# EAGLE design nrf52840-breakout-qwiic-lipo (EAGLE 9.1.2)
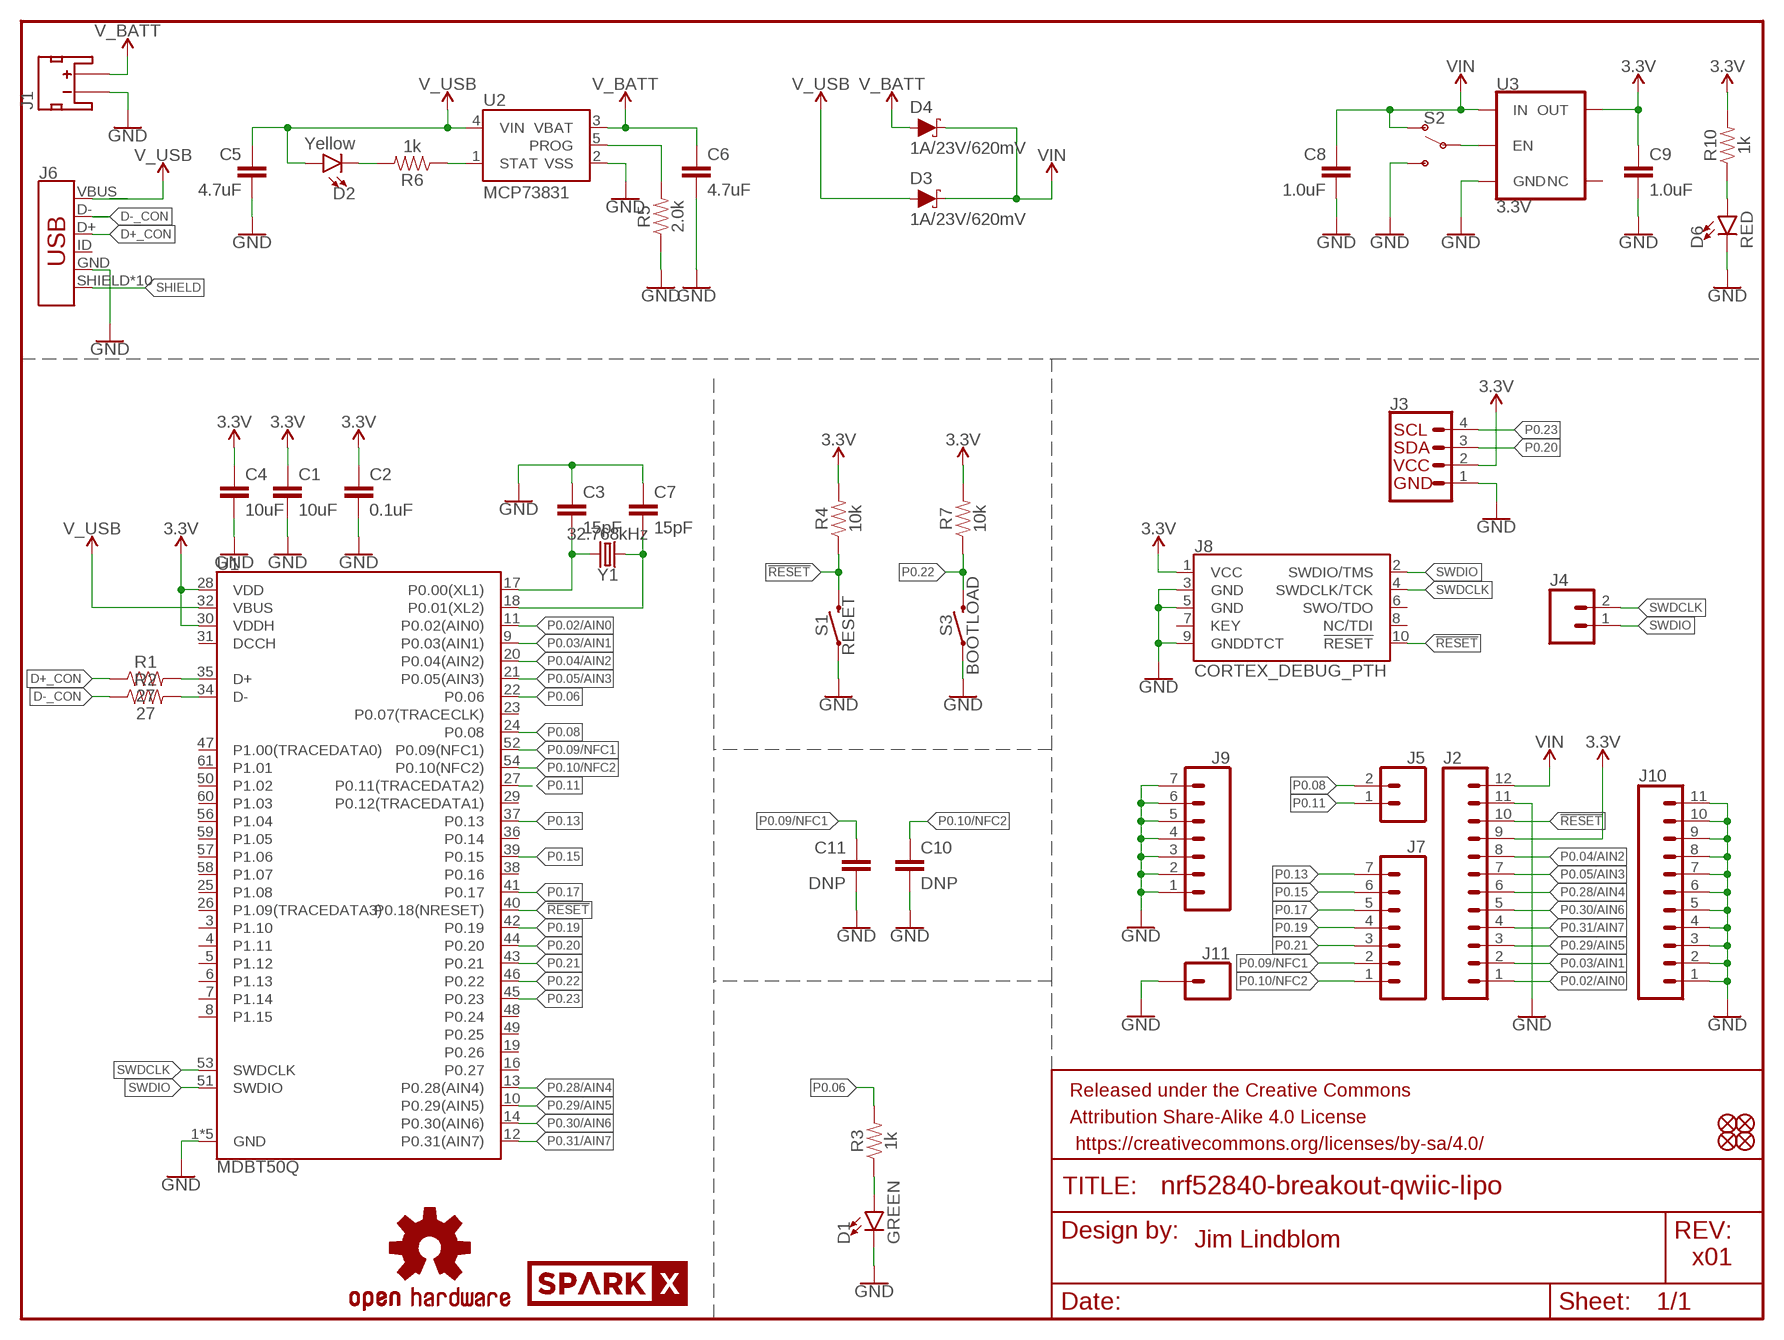
[diagram p0: schematic, sheet 1]

## Parts
C1  10uF  10UF-0603-6.3V-20%  [0603]
C2  0.1uF  0.1UF-0603-25V-(+80/-20%)  [0603]
C3  15pF  15PF-0603-50V-5%  [0603]
C4  10uF  10UF-0603-6.3V-20%  [0603]
C5  4.7uF  4.7UF-0603-6.3V-(10%)  [0603]
C6  4.7uF  4.7UF-0603-6.3V-(10%)  [0603]
C7  15pF  15PF-0603-50V-5%  [0603]
C8  1.0uF  1.0UF-0603-16V-10%  [0603]
C9  1.0uF  1.0UF-0603-16V-10%  [0603]
C10  DNP  270PF-0603-50V-5%  [0603]
C11  DNP  270PF-0603-50V-5%  [0603]
D1  GREEN  LED-GREEN0603  [LED-0603]
D2  Yellow  LED-YELLOW0603  [LED-0603]
D3  1A/23V/620mV  DIODE-SCHOTTKY-BAT20J  [SOD-323]
D4  1A/23V/620mV  DIODE-SCHOTTKY-BAT20J  [SOD-323]
D6  RED  LED-RED0603  [LED-0603]
FD1  FIDUCIALUFIDUCIAL  [FIDUCIAL-MICRO]
FD2  FIDUCIALUFIDUCIAL  [FIDUCIAL-MICRO]
FD3  FIDUCIALUFIDUCIAL  [FIDUCIAL-MICRO]
FD4  FIDUCIALUFIDUCIAL  [FIDUCIAL-MICRO]
FRAME1  FRAME-LETTER  [CREATIVE_COMMONS]
J1  JST_2MM_MALESMD  [JST-2-SMD]
J2  CONN_12NO_SILK  [1X12_NO_SILK]
J3  QWIIC_CONNECTORJS-1MM  [1X04_1MM_RA]
J4  CONN_021X02_NO_SILK  [1X02_NO_SILK]
J5  CONN_021X02_NO_SILK  [1X02_NO_SILK]
J6  USB_MICRO-B_HALF_PTH_MILL  [USB-MICROB-PTH-MILL]
J7  CONN_07NO_SILK  [1X07_NO_SILK]
J8  CORTEX_DEBUG_PTH  [2X5-PTH-1.27MM]
J9  CONN_07NO_SILK  [1X07_NO_SILK]
J10  CONN_111X11_NO_SILK  [1X11_NO_SILK]
J11  CONN_01PTH_NO_SILK_YES_STOP  [1X01_NO_SILK]
LOGO1  SPARKX-LOGO3  [SPARKX-SMALL]
LOGO2  OSHW-LOGOM  [OSHW-LOGO-M]
R1  27  27OHM-0603-1/10W-1%  [0603]
R2  27  27OHM-0603-1/10W-1%  [0603]
R3  1k  1KOHM-0603-1/10W-1%  [0603]
R4  10k  10KOHM-0603-1/10W-1%  [0603]
R5  2.0k  2.0KOHM-0603-1/10W-5%  [0603]
R6  1k  1KOHM-0603-1/10W-1%  [0603]
R7  10k  10KOHM-0603-1/10W-1%  [0603]
R10  1k  1KOHM-0603-1/10W-1%  [0603]
S1  RESET  MOMENTARY-SWITCH-SPST-SMD-RIGHT-ANGLE  [TACTILE_SWITCH_SMD_RIGHT_ANGLE]
S2  SWITCH-SPDT-SMD-RIGHT-ANGLE  [SWITCH_SPST_SMD_A]
S3  BOOTLOAD  MOMENTARY-SWITCH-SPST-SMD-RIGHT-ANGLE  [TACTILE_SWITCH_SMD_RIGHT_ANGLE]
U1  MDBT50Q  [MDBT50Q]
U2  MCP73831  [SOT23-5]
U3  3.3V  V_REG_AP2112K-3.3V  [SOT23-5]
Y1  32.768kHz  CRYSTAL-32.768KHZSMD-3.2X1.5  [CRYSTAL-SMD-3.2X1.5MM]

## Nets
3.3V [vcc]: C1.1 C2.1 C4.1 C9.1 J2.9 J3.2 J8.1(VCC) R4.2 R7.2 R10.2 U1.28(VDD) U1.30(VDDH) U3.5(OUT)
!RESET: J2.10 J8.10(!RESET) R4.1 S1.2 U1.40(P0.18(NRESET))
D+: R1.2 U1.35(D+)
D+_CON: J6.D+ R1.1
D-: R2.2 U1.34(D-)
D-_CON: J6.D- R2.1
GND: C1.2 C2.2 C3.1 C4.2 C5.2 C6.2 C7.1 C8.2 C9.2 C10.2 C11.2 D1.C D6.C J1.1(-) J2.11 J3.1 J6.GND J8.3(GND) J8.5(GND) J8.9(GNDDTCT) J9.1 J9.2 J9.3 J9.4 J9.5 J9.6 J9.7 J10.1 J10.2 J10.3 J10.4 J10.5 J10.6 J10.7 J10.8 J10.9 J10.10 J10.11 J11.1 R5.1 S1.1 S2.3(S) S3.1 U1.1(GND) U1.2(GND) U1.15(GND) U1.33(GND) U1.55(GND) U2.2(VSS) U3.2(GND)
N$1: R5.2 U2.5(PROG)
N$2: S2.2(P) U3.3(EN)
N$3: D2.C R6.2
N$4: R6.1 U2.1(STAT)
N$7: D1.A R3.1
N$10: D6.A R10.1
P0.02/AIN0: J2.1 U1.11(P0.02(AIN0))
P0.03/AIN1: J2.2 U1.9(P0.03(AIN1))
P0.04/AIN2: J2.8 U1.20(P0.04(AIN2))
P0.05/AIN3: J2.7 U1.21(P0.05(AIN3))
P0.06: R3.2 U1.22(P0.06)
P0.08: J5.2 U1.24(P0.08)
P0.09/NFC1: C11.1 J7.2 U1.52(P0.09(NFC1))
P0.10/NFC2: C10.1 J7.1 U1.54(P0.10(NFC2))
P0.11: J5.1 U1.27(P0.11(TRACEDATA2))
P0.13: J7.7 U1.37(P0.13)
P0.15: J7.6 U1.39(P0.15)
P0.17: J7.5 U1.41(P0.17)
P0.19: J7.4 U1.42(P0.19)
P0.20: J3.3 U1.44(P0.20)
P0.21: J7.3 U1.43(P0.21)
P0.22: R7.1 S3.2 U1.46(P0.22)
P0.23: J3.4 U1.45(P0.23)
P0.28/AIN4: J2.6 U1.13(P0.28(AIN4))
P0.29/AIN5: J2.3 U1.10(P0.29(AIN5))
P0.30/AIN6: J2.5 U1.14(P0.30(AIN6))
P0.31/AIN7: J2.4 U1.12(P0.31(AIN7))
SHIELD: J6.SHIELD J6.SHIELD2(SHIELD) J6.SHIELD3(SHIELD) J6.SHIELD4(SHIELD) J6.SHIELD5(SHIELD) J6.SHIELD6(SHIELD) J6.SHIELD7(SHIELD) J6.SHIELD8(SHIELD) J6.SHIELD9(SHIELD) J6.SHIELD10(SHIELD)
SWDCLK: J4.2 J8.4(SWDCLK/TCK) U1.53(SWDCLK)
SWDIO: J4.1 J8.2(SWDIO/TMS) U1.51(SWDIO)
V_BATT: C6.1 D4.A J1.2(+) U2.3(VBAT)
V_USB: C5.1 D2.A D3.A J6.VBUS U1.32(VBUS) U2.4(VIN)
VIN [vcc]: C8.1 D3.C D4.C J2.12 S2.1(O) U3.1(IN)
XL1: C3.2 U1.17(P0.00(XL1)) Y1.P$2
XL2: C7.2 U1.18(P0.01(XL2)) Y1.P$1
Unconnected: J6.ID J8.6(SWO/TDO) J8.7(KEY) J8.8(NC/TDI) U1.3(P1.10) U1.4(P1.11) U1.5(P1.12) U1.6(P1.13) U1.7(P1.14) U1.8(P1.15) U1.16(P0.27) U1.19(P0.26) U1.23(P0.07(TRACECLK)) U1.25(P1.08) U1.26(P1.09(TRACEDATA3)) U1.29(P0.12(TRACEDATA1)) U1.31(DCCH) U1.36(P0.14) U1.38(P0.16) U1.47(P1.00(TRACEDATA0)) U1.48(P0.24) U1.49(P0.25) U1.50(P1.02) U1.56(P1.04) U1.57(P1.06) U1.58(P1.07) U1.59(P1.05) U1.60(P1.03) U1.61(P1.01) U3.4(NC)

## Notes on the sheet
- Jim Lindblom
- x01

## Library data of the parts
C1 C4 = SparkFun-Capacitors:10UF: 10.0µF ceramic capacitors A capacitor is a passive two-terminal electrical component used to store electrical energy temporarily in an electric field.; PROD_ID: CAP-11015
C2 = SparkFun-Capacitors:0.1UF: 0.1µF ceramic capacitors A capacitor is a passive two-terminal electrical component used to store electrical energy temporarily in an electric field.; PROD_ID: CAP-00810
C3 C7 = SparkFun-Capacitors:15PF: 15pF ceramic capacitors A capacitor is a passive two-terminal electrical component used to store electrical energy temporarily in an electric field.; PROD_ID: CAP-07881
C5 C6 = SparkFun-Capacitors:4.7UF: 4.7µF ceramic capacitors A capacitor is a passive two-terminal electrical component used to store electrical energy temporarily in an electric field.; PROD_ID: CAP-08280
C8 C9 = SparkFun-Capacitors:1.0UF: 1µF ceramic capacitors A capacitor is a passive two-terminal electrical component used to store electrical energy temporarily in an electric field.; PROD_ID: CAP-00868
C10 C11 = SparkFun-Capacitors:270PF: 270pF/0.27nF ceramic capacitors A capacitor is a passive two-terminal electrical component used to store electrical energy temporarily in an electric field.; PROD_ID: CAP-13339; VALUE: 270PF
D1 = SparkFun-LED:LED-GREEN: Green SMD LED Used in manufacturing of various products at SparkFun Packages: 0603 - SMD 0603 package [Product Link] <http://www.futureelectronics.com/en/technologies/semiconductors/optoelectronics/leds/Pages/9894312-LTST-C190GKT.aspx?CrossPart=HSMG-C190&IM=0> LilyPad 1206 - SMD1206 LilyPad package [Product Link] <http://www.futureelectronics.com/en/Technologies/Product.aspx?ProductID=IN150NGHARVATEKCORPORATION2049943&IM=0> 1206 - SMD1206 package [Product Link] <http://www.futureelectronics.com/en/technologies/semiconductors/optoelectronics/leds/Pages/8315665-LTST-C150KGKT.aspx?IM=0> 1206 Bottom Mount -SMD 1206 Bottom Mount [Product Link] <http://www.digikey.com/product-detail/en/lite-on-inc/LTST-C230KGKT/160-1456-1-ND/386854> SparkFun Products: Pro Mini 328 -5V <https://www.sparkfun.com/products/821> RedBoard <https://www.sparkfun.com/products/12757> MP3 Trigger <https://www.sparkfun.com/products/13720> Makey Makey <https://www.sparkfun.com/products/11076>; PROD_ID: DIO-00821
D2 = SparkFun-LED:LED-YELLOW: Yellow SMD LED Used in manufacturing several products at SparkFun. Packages: 0603 - SMD 0603 package[Product Link] <http://www.kingbrightusa.com/product.asp?catalog_name=LED&product_id=APT1608SYCK> 0603 -SMART - SMART SMD 0603 package (more efficient/more expensive) [Product Link] <http://www.osram-os.com/osram_os/en/products/product-catalog/led-light-emitting-diodes/smartled-0603/ly-l29k/index.jsp> LilyPad - SMD1206 package[Product Datasheet] <https://www.sparkfun.com/datasheets/DevTools/LilyPad/Q150YUS4.pdf> SparkFun Products: Blynk Board <https://www.sparkfun.com/products/13794> IOIO-OTG <https://www.sparkfun.com/products/13613> XBee Explorer Serial <https://www.sparkfun.com/products/13225>; PROD_ID: DIO-09003
D3 D4 = SparkFun-DiscreteSemi:DIODE-SCHOTTKY: Schottky diode A Schottky diode is a semiconductor diode which has a low forward voltage drop and a very fast switching action.; PROD_ID: DIO-11623
D6 = SparkFun-LED:LED-RED: Red SMD LED Used in manufacturing of most products at SparkFun Packages: 0603 - SMD 0603 package [Product Link] <http://docs.avagotech.com/docs/AV02-0551EN> 0603 SMART - SMD 0603 SMART package ( more efficient and expensive)[Product Link] <http://www.osram-os.com/Graphics/XPic2/00077099_0.pdf> 1206 - SMD1206 package [Product Link] <https://www.sparkfun.com/datasheets/DevTools/LilyPad/Q150OVS4.pdff> SparkFun Products: Pro Mini 328 -5V <https://www.sparkfun.com/products/821> RedBoard <https://www.sparkfun.com/products/12757> IOIO-OTG <https://www.sparkfun.com/products/13613>; PROD_ID: DIO-00819
FD1-FD4 = SparkFun-Aesthetics:FIDUCIAL: Fiducial Alignment Points Point-of-reference for pick-and-place machines and other optical instruments.
FRAME1 = SparkFun-Aesthetics:FRAME-LETTER: Schematic Frame - Letter Standard 8.5x11 US Letter frame
J1 = SparkFun-Connectors:JST_2MM_MALE: JST 2MM MALE RA CONNECTOR Two pin, compact surface mount connector. Commonly used as a battery input connection point. We really like the solid locking feeling and high current rating on these small connectors. We use these all the time as battery connectors. Mates to single-cell LiPo batteries. Here is the connector we sell at SparkFun: JST Right Angle Connector - White <https://www.sparkfun.com/products/8612> (PRT-08612) Datasheet <http://www.sparkfun.com/datasheets/Prototyping/Connectors/JST-Horizontal.pdf> It was used on these SparkFun products: SparkFun MOSFET Power Controller <https://www.sparkfun.com/products/11214> (PRT-11214) SparkFun Battery Babysitter - LiPo Battery Manager <https://www.sparkfun.com/products/13777> (PRT-13777) And many, many others that required a lipo battery connection.; PROD_ID: CONN-11443; SF_ID: PRT-08612
J2 = SparkFun-Connectors:CONN_12: Multi connection point. Often used as Generic Header-pin footprint for 0.1 inch spaced/style header connections On any of the 0.1 inch spaced packages, you can populate with these: Break Away Headers - Straight <https://www.sparkfun.com/products/116> (PRT-00116) Break Away Male Headers - Right Angle <https://www.sparkfun.com/products/553> (PRT-00553) Female Headers <https://www.sparkfun.com/products/115> (PRT-00115) Break Away Headers - Machine Pin <https://www.sparkfun.com/products/117> (PRT-00117) Break Away Female Headers - Swiss Machine Pin <https://www.sparkfun.com/products/743> (PRT-00743) For SCREWTERMINALS and SPRING TERMINALS visit here: Screw Terimnals on SparkFun.com <https://www.sparkfun.com/search/results?term=Screw+Terminals> (5mm/3.5mm/2.54mm spacing) This device is also useful as a general connection point to wire up your design to another part of your project. Our various solder wires solder well into these plated through hole pads. Hook-Up Wire - Assortment (Stranded, 22 AWG) <https://www.sparkfun.com/products/11375> (PRT-11375) Hook-Up Wire - Assortment (Solid Core, 22 AWG) <https://www.sparkfun.com/products/11367> (PRT-11367) View the entire wire category on our website here <https://www.sparkfun.com/categories/141> Special notes: Molex polarized connector foot print use with SKU : PRT-08231 with associated crimp pins and housings. 1MM SMD Version SKU: PRT-10208 NOTES ON THE VARIANTS LOCK and LOCK_LONGPADS... This footprint was designed to help hold the alignment of a through-hole component (i.e. 6-pin header) while soldering it into place. You may notice that each hole has been shifted either up or down by 0.005 of an inch from it's more standard position (which is a perfectly straight line). This slight alteration caused the pins (the squares in the middle) to touch the edges of the holes. Because they are alternating, it causes a "brace" to hold the component in place. 0.005 has proven to be the perfect amount of "off-center" position when using our standard breakaway headers. Although looks a little odd when you look at the bare footprint, once you have a header in there, the alteration is very hard to notice. Also,if you push a header all the way into place, it is covered up entirely on the bottom side.
J3 = SparkFun-Connectors:QWIIC_CONNECTOR: SparkFun I2C Standard Qwiic Connector An SMD 1mm pitch JST connector makes it easy and quick (get it? Qwiic?) to connect I2C devices to each other. The Qwiic system <http://www.sparkfun.com/qwiic> enables fast and solderless connection between popular platforms and various sensors and actuators. We carry 200mm <https://www.sparkfun.com/products/14204>, 100mm <https://www.sparkfun.com/products/14205>, 50mm <https://www.sparkfun.com/products/14206>, and breadboard friendly <https://www.sparkfun.com/products/14207> Qwiic cables. We also offer 10 pcs strips <https://www.sparkfun.com/products/14323> the SMD connectors.; PROD_ID: CONN-13694
J4 J5 = SparkFun-Connectors:CONN_02: Multi connection point. Often used as Generic Header-pin footprint for 0.1 inch spaced/style header connections On any of the 0.1 inch spaced packages, you can populate with these: Break Away Headers - Straight <https://www.sparkfun.com/products/116> (PRT-00116) Break Away Male Headers - Right Angle <https://www.sparkfun.com/products/553> (PRT-00553) Female Headers <https://www.sparkfun.com/products/115> (PRT-00115) Break Away Headers - Machine Pin <https://www.sparkfun.com/products/117> (PRT-00117) Break Away Female Headers - Swiss Machine Pin <https://www.sparkfun.com/products/743> (PRT-00743) For SCREWTERMINALS and SPRING TERMINALS visit here: Screw Terimnals on SparkFun.com <https://www.sparkfun.com/search/results?term=Screw+Terminals> (5mm/3.5mm/2.54mm spacing) This device is also useful as a general connection point to wire up your design to another part of your project. Our various solder wires solder well into these plated through hole pads. Hook-Up Wire - Assortment (Stranded, 22 AWG) <https://www.sparkfun.com/products/11375> (PRT-11375) Hook-Up Wire - Assortment (Solid Core, 22 AWG) <https://www.sparkfun.com/products/11367> (PRT-11367) View the entire wire category on our website here <https://www.sparkfun.com/categories/141> Special notes: Molex polarized connector foot print use with: PRT-08233 with associated crimp pins and housings. 2.54_SCREWTERM for use with PRT-10571. 3.5mm Screw Terminal footprints for PRT-08084 5mm Screw Terminal footprints for use with PRT-08432
J6 = SparkFun-Connectors:USB_MICRO-B: USB Type Micro-B Connector Male/female and PTH/SMT variants SparkFun Products: SparkFun microB USB Breakout <https://www.sparkfun.com/products/12035> SparkFun USB microB Plug Breakout <https://www.sparkfun.com/products/10031> SparkFun ESP8266 Thing <https://www.sparkfun.com/products/13231>; PROD_ID: CONN-13711
J7 J9 = SparkFun-Connectors:CONN_07: Multi connection point. Often used as Generic Header-pin footprint for 0.1 inch spaced/style header connections On any of the 0.1 inch spaced packages, you can populate with these: Break Away Headers - Straight <https://www.sparkfun.com/products/116> (PRT-00116) Break Away Male Headers - Right Angle <https://www.sparkfun.com/products/553> (PRT-00553) Female Headers <https://www.sparkfun.com/products/115> (PRT-00115) Break Away Headers - Machine Pin <https://www.sparkfun.com/products/117> (PRT-00117) Break Away Female Headers - Swiss Machine Pin <https://www.sparkfun.com/products/743> (PRT-00743) For SCREWTERMINALS and SPRING TERMINALS visit here: Screw Terimnals on SparkFun.com <https://www.sparkfun.com/search/results?term=Screw+Terminals> (5mm/3.5mm/2.54mm spacing) This device is also useful as a general connection point to wire up your design to another part of your project. Our various solder wires solder well into these plated through hole pads. Hook-Up Wire - Assortment (Stranded, 22 AWG) <https://www.sparkfun.com/products/11375> (PRT-11375) Hook-Up Wire - Assortment (Solid Core, 22 AWG) <https://www.sparkfun.com/products/11367> (PRT-11367) View the entire wire category on our website here <https://www.sparkfun.com/categories/141> Special notes: Molex polarized connector foot print use with SKU : PRT-08231 with associated crimp pins and housings. 1MM SMD Version SKU: PRT-10208 NOTES ON THE VARIANTS LOCK and LOCK_LONGPADS... This footprint was designed to help hold the alignment of a through-hole component (i.e. 6-pin header) while soldering it into place. You may notice that each hole has been shifted either up or down by 0.005 of an inch from it's more standard position (which is a perfectly straight line). This slight alteration caused the pins (the squares in the middle) to touch the edges of the holes. Because they are alternating, it causes a "brace" to hold the component in place. 0.005 has proven to be the perfect amount of "off-center" position when using our standard breakaway headers. Although looks a little odd when you look at the bare footprint, once you have a header in there, the alteration is very hard to notice. Also,if you push a header all the way into place, it is covered up entirely on the bottom side.
J8 = SparkFun-Connectors:CORTEX_DEBUG: Cortex Debug Connector - 10 pin Supports JTAG debug, Serial Wire debug, and Serial Wire Viewer. PTH and SMD connector options available. General Connector Information <http://infocenter.arm.com/help/topic/com.arm.doc.faqs/attached/13634/cortex_debug_connectors.pdf> Products: PTH Connector <http://www.digikey.com/product-detail/en/cnc-tech/3220-10-0100-00/1175-1627-ND/3883661> -via Digi-Key SparkFun PSoc <https://www.sparkfun.com/products/13229> SparkFun T <https://www.sparkfun.com/products/13810>
J10 = SparkFun-Connectors:CONN_11: Multi connection point. Often used as Generic Header-pin footprint for 0.1 inch spaced/style header connections On any of the 0.1 inch spaced packages, you can populate with these: Break Away Headers - Straight <https://www.sparkfun.com/products/116> (PRT-00116) Break Away Male Headers - Right Angle <https://www.sparkfun.com/products/553> (PRT-00553) Female Headers <https://www.sparkfun.com/products/115> (PRT-00115) Break Away Headers - Machine Pin <https://www.sparkfun.com/products/117> (PRT-00117) Break Away Female Headers - Swiss Machine Pin <https://www.sparkfun.com/products/743> (PRT-00743) For SCREWTERMINALS and SPRING TERMINALS visit here: Screw Terimnals on SparkFun.com <https://www.sparkfun.com/search/results?term=Screw+Terminals> (5mm/3.5mm/2.54mm spacing) This device is also useful as a general connection point to wire up your design to another part of your project. Our various solder wires solder well into these plated through hole pads. Hook-Up Wire - Assortment (Stranded, 22 AWG) <https://www.sparkfun.com/products/11375> (PRT-11375) Hook-Up Wire - Assortment (Solid Core, 22 AWG) <https://www.sparkfun.com/products/11367> (PRT-11367) View the entire wire category on our website here <https://www.sparkfun.com/categories/141>
J11 = SparkFun-Connectors:CONN_01: Single connection point. Often used as Generic Header-pin footprint for 0.1 inch spaced/style header connections On any of the 0.1 inch spaced packages, you can populate with these: Break Away Headers - Straight <https://www.sparkfun.com/products/116> (PRT-00116) Break Away Male Headers - Right Angle <https://www.sparkfun.com/products/553> (PRT-00553) Female Headers <https://www.sparkfun.com/products/115> (PRT-00115) Break Away Headers - Machine Pin <https://www.sparkfun.com/products/117> (PRT-00117) Break Away Female Headers - Swiss Machine Pin <https://www.sparkfun.com/products/743> (PRT-00743) This device is also useful as a general connection point to wire up your design to another part of your project. Our various solder wires solder well into these plated through hole pads. Hook-Up Wire - Assortment (Stranded, 22 AWG) <https://www.sparkfun.com/products/11375> (PRT-11375) Hook-Up Wire - Assortment (Solid Core, 22 AWG) <https://www.sparkfun.com/products/11367> (PRT-11367) View the entire wire category on our website here <https://www.sparkfun.com/categories/141> Special notes: SMTSO-256-ET is a "flush mount" nut for a 4-40 screw. We mostly use this on specialty testbeds; it is a nice way to connect hardware to your PCB at an adjustable hieght. Also note, the SNAP packages are for using a snappable style connector. We sell a baggie of snaps and they are also used on two LilyPad designs: Snap Assortment - 30 pack (male and female) <https://www.sparkfun.com/products/11347> (DEV-11347) LilyPad Arduino SimpleSnap <https://www.sparkfun.com/products/10941> (DEV-10941) LilyPad SimpleSnap Protoboard <https://www.sparkfun.com/products/10940> (DEV-10940)
LOGO1 = SparkX:SPARKX-LOGO
LOGO2 = SparkFun-Aesthetics:OSHW-LOGO: Open-Source Hardware (OSHW) Logo This logo indicates the piece of hardware it is found on incorporates a OSHW license and/or adheres to the definition of open source hardware found here: http://freedomdefined.org/OSHW
R1 R2 = SparkFun-Resistors:27OHM: 27Ω resistor A resistor is a passive two-terminal electrical component that implements electrical resistance as a circuit element. Resistors act to reduce current flow, and, at the same time, act to lower voltage levels within circuits. - Wikipedia; PROD_ID: RES-09334
R3 R6 R10 = SparkFun-Resistors:1KOHM: 1kΩ resistor A resistor is a passive two-terminal electrical component that implements electrical resistance as a circuit element. Resistors act to reduce current flow, and, at the same time, act to lower voltage levels within circuits. - Wikipedia; PROD_ID: RES-07856
R4 R7 = SparkFun-Resistors:10KOHM: 10kΩ resistor A resistor is a passive two-terminal electrical component that implements electrical resistance as a circuit element. Resistors act to reduce current flow, and, at the same time, act to lower voltage levels within circuits. - Wikipedia; PROD_ID: RES-00824
R5 = SparkFun-Resistors:2.0KOHM: 2kΩ resistor A resistor is a passive two-terminal electrical component that implements electrical resistance as a circuit element. Resistors act to reduce current flow, and, at the same time, act to lower voltage levels within circuits. - Wikipedia; PROD_ID: RES-08296
S1 S3 = SparkFun-Switches:MOMENTARY-SWITCH-SPST: Momentary Switch (Pushbutton) - SPST Normally-open (NO) SPST momentary switches (buttons, pushbuttons). Variants PTH-12MM - 12mm square, through-hole Momentary Pushbutton Switch - 12mm Square <https://www.sparkfun.com/products/9190> (COM-09190) PTH-6.0MM, PTH-6.0MM-KIT - 6.0mm square, through-hole Mini Pushbutton Switch <https://www.sparkfun.com/products/97> (COM-00097) KIT package intended for soldering kit's - only one side of pads' copper is exposed. PTH-RIGHT-ANGLE-KIT - Right-angle, through-hole Right Angle Tactile Button <https://www.sparkfun.com/products/10791> - Used on SparkFun BigTime Watch Kit <https://www.sparkfun.com/products/11734> SMD-12MM - 12mm square, surface-mount Tactile Button - SMD (12mm) <https://www.sparkfun.com/products/12993> (COM-12993) Used on SparkFun PicoBoard <https://www.sparkfun.com/products/11888> SMD-4.5MM - 4.5mm Square Trackball Switch Used on SparkFun Blackberry Trackballer Breakout <https://www.sparkfun.com/products/13169> SMD-4.6MMX2.8MM - 4.60mm x 2.80mm, surface mount Used on SparkFun SAMD21 Mini Breakout <https://www.sparkfun.com/products/13664> SMD-5.2MM, SMD-5.2-REDUNDANT - 5.2mm square, surface-mount Mini Pushbutton Switch - SMD <https://www.sparkfun.com/products/8720> (COM-08720) Used on Arduino Pro Mini <https://www.sparkfun.com/products/11114> REDUNDANT package connects both switch circuits together SMD-6.0X3.5MM - 6.0 x 3.5mm, surface mount Momentary Reset Switch SMD <https://www.sparkfun.com/products/8229> (COM-08229) SMD-6.2MM-TALL - 6.2mm square, surface mount Tactile Button - SMD (6mm) <https://www.sparkfun.com/products/12992> Used on SparkFun Digital Sandbox <https://www.sparkfun.com/products/12651> SMD-RIGHT-ANGLE - Right-angle, surface mount Used on SparkFun Block for Intel® Edison - Arduino <https://www.sparkfun.com/products/13036>; PROD_ID: COMP-12265
S2 = SparkFun-Switches:SWITCH-SPDT: Single Pole, Double Throw (SPDT) Switch Single-pole, double-throw (SPDT) switch. Variant Overview SMD-AYZ0202 Surface Mount DPDT Switch <https://www.sparkfun.com/products/597> (COM-00597) Used on e.g. LilyPad Arduino USB - ATmega32U4 Board <https://www.sparkfun.com/products/12049> PTH-11.6X4.0MM SPDT Mini Power Switch <https://www.sparkfun.com/products/102> (COM-00102) Used on e.g. SparkFun Simon Says - Through-Hole Soldering Kit <https://www.sparkfun.com/products/10547> (KIT-10547) PTH-11.6X4.0MM-KIT KIT version of SPDT Mini Power Switch - Simplifies soldering by removing tStop of switch pins - only one side can be soldered. PTH-11.6X4.0MM-LOCK LOCK version of SPDT Mini Power Switch - Offset pins hold switch in place for easier soldering. SMD-RIGHT-ANGLE Surface Mount Right Angle Switch <https://www.sparkfun.com/products/10860> (COM-10860) Used on e.g. SparkFun ESP8266 Thing <https://www.sparkfun.com/products/13231>; PROD_ID: SWCH-10651; SF_SKU: COM-10860
U1 = nrf52840:MDBT50Q
U2 = SparkFun-IC-Power:MCP73831: MCP73831T Li-Ion, Li-Pol Controller Miniature single cell, fully integrated Li-Ion, Li-polymer charge management controller Datasheet <http://ww1.microchip.com/downloads/en/DeviceDoc/20001984g.pdf> SparkFun Products: SparkFun ESP32 Thing <https://www.sparkfun.com/products/13907> SparkFun 9DoF Razor IMU M0 <https://www.sparkfun.com/products/14001>; PROD_ID: IC-09995
U3 = SparkFun-IC-Power:V_REG_AP2112: AP2112 - 600mA CMOS LDO Regulator w/ Enable The AP2112 is CMOS process low dropout linear regulator with enable function, the regulator delivers a guaranteed 600mA (min.) continuous load current. Features Output Voltage Accuracy: ±1.5% Output Current: 600mA (Min.) Foldback Short Current Protection: 50mA Enable Function to Turn ON/OFF VOUT Low Dropout Voltage (3.3V): 250mV (Typ.) @IOUT=600mA Excellent Load Regulation: 0.2%/A (Typ.) Excellent Line Regulation: 0.02%/V (Typ.) Low Quiescent Current: 55μA (Typ.) Low Standby Current: 0.01μA (Typ.) Low Output Noise: 50μVRMS PSRR: 100Hz -65dB, 1kHz -65dB OTSD Protection Stable with 1.0μF Flexible Cap: Ceramic, Tantalum and Aluminum Electrolytic Operation Temperature Range: -40°C to 85°C ESD: MM 400V, HBM 4000V; PROD_ID: VREG-12457
Y1 = SparkFun-Clocks:CRYSTAL-32.768KHZ: 32.768kHz Crystal Frequency: 32.768kHz Frequency Stability: ±20ppm Load Capacitance: 12.5pF (PTH-2X6 & SMD-3.2X1.5), 6pF (SMD-2X6) SparkFun Products: SparkFun BigTime Watch Kit <https://www.sparkfun.com/products/11734> SparkFun nRF52832 Breakout <https://www.sparkfun.com/products/13990> SparkFun Real Time Clock Module <https://www.sparkfun.com/products/12708>; PROD_ID: XTAL-13062

## Net classes
0 default: width 0 mm, drill 0 mm
1 vcc: width 0 mm

## Board
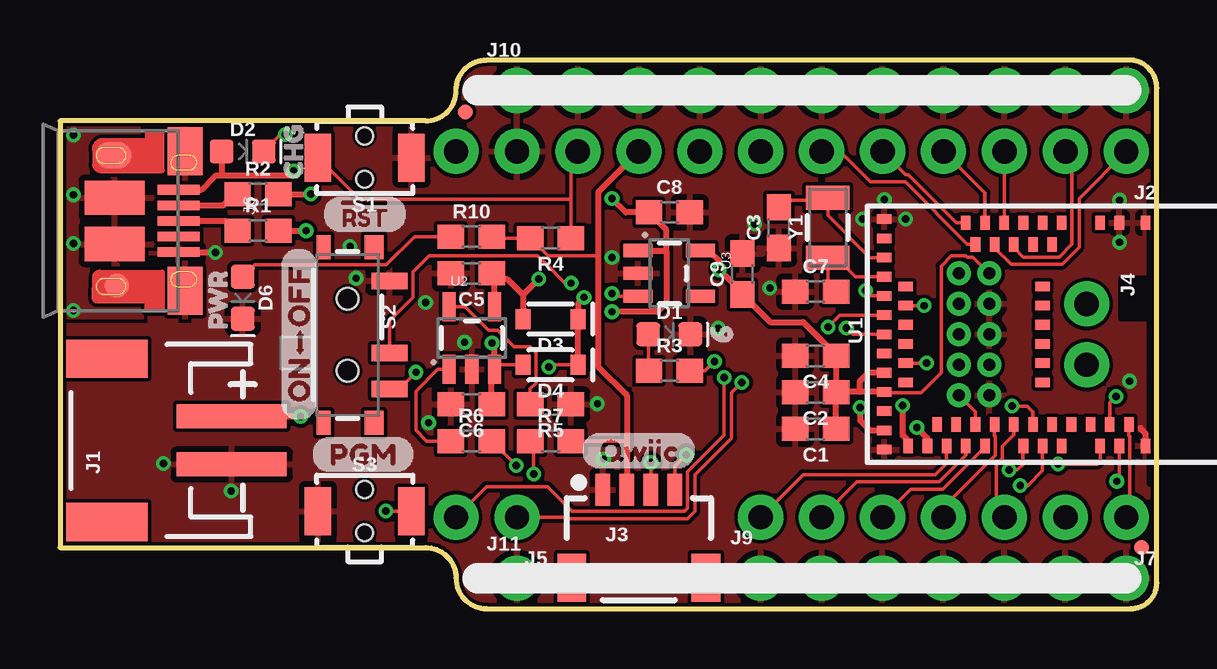
[diagram p1: board, top side]
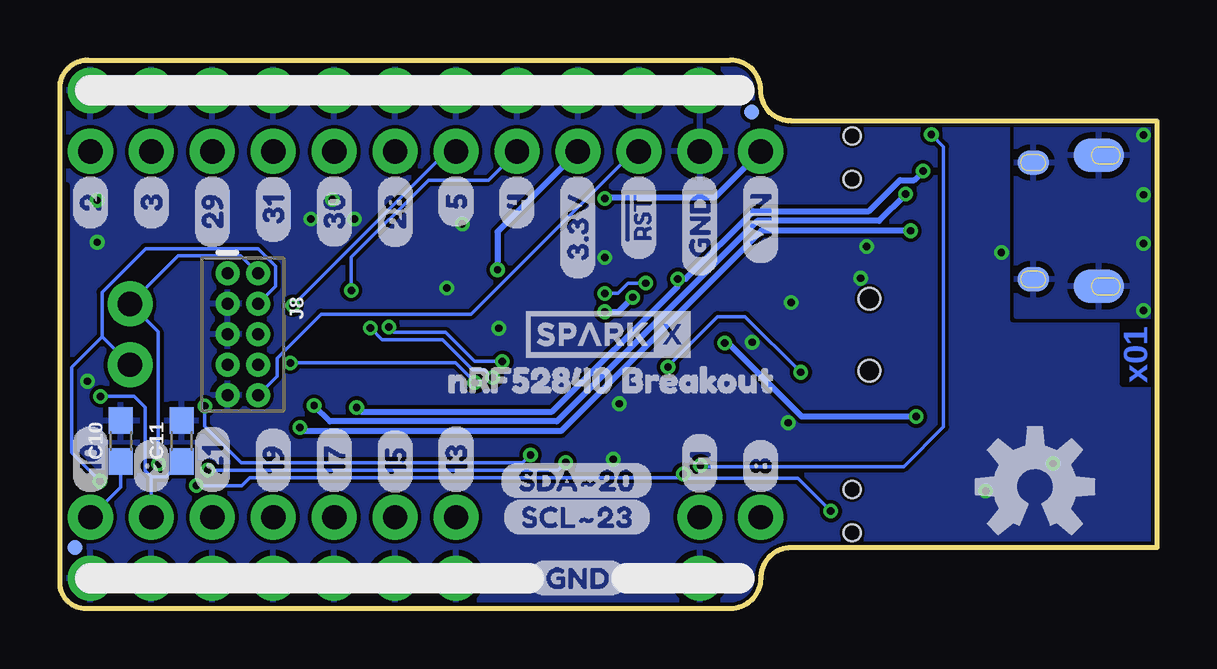
[diagram p2: board, bottom side, seen from below]

Size 45.72 x 22.86 mm. Coordinates in mm from the lower left corner, seen from the top.
Outline: 0,2.54 15.24,2.54 arc-90 16.51,1.27 arc90 17.78,0 44.65,0 arc90 45.72,1.07 45.72,21.7 arc90 44.56,22.86 17.78,22.86 arc90 16.51,21.59 arc-90 15.24,20.32 0,20.32 0,2.54
Copper layers (1*16): Top 0.035mm / dielectric 1.5mm / Bottom 0.035mm
Design rules "SparkFun-2-layer-PCBWay-LIMIT": minimum track width 6mil, minimum drill 0.3mm, track to track 6mil, track to pad 6mil, pad to pad 6mil, via to via 6mil, smd to smd 6mil, copper to edge 6mil, drill to drill 6mil, minimum pad ring 6mil, minimum via ring 6mil, stop-mask expansion 4mil, vias tented up to drill 25mil, thermal gap 10mil

### Footprints (pad centres in the part's own frame; a part is rotated, then mirrored left to right if it is on the bottom)
0603 = smd 1.1 x 1: 1 -0.85,0; 2 0.85,0
LED-0603 = smd 1 x 1: A -0.877,0; C 0.877,0
SOD-323 = smd 0.63 x 0.83: A 1.15,0; C -1.15,0
FIDUCIAL-MICRO = smd 0.635 x 0.635: 1 0,0
JST-2-SMD = smd 1 x 4.6: 1 -1,-3.7; 2 1,-3.7 | smd 1.6 x 3.4: NC1 -3.4,1.5; NC2 3.4,1.5
1X12_NO_SILK = drill 1.016 pad 1.88: 1 0,0; 2 2.54,0; 3 5.08,0; 4 7.62,0; 5 10.16,0; 6 12.7,0; 7 15.24,0; 8 17.78,0; 9 20.32,0; 10 22.86,0; 11 25.4,0; 12 27.94,0
1X04_1MM_RA = smd 0.6 x 1.35: 1 -1.5,0; 2 -0.5,0; 3 0.5,0; 4 1.5,0 | smd 1.2 x 2: NC1 2.8,-3.675; NC2 -2.8,-3.675
1X02_NO_SILK = drill 1.016 pad 1.88: 1 0,0; 2 2.54,0
USB-MICROB-PTH-MILL = smd 0.4 x 1.75: D+ 0,0; D- -0.65,0; GND 1.3,0; ID 0.65,0; VBUS -1.3,0 | smd 2 x 1.46: SHIELD -2.9,0.275; SHIELD2 2.9,0.275 | smd 1.425 x 2.5: SHIELD3 -0.963,-2.675; SHIELD4 0.963,-2.675 | smd 1.4 x 2.1 bottom: SHIELD5 -2.731,-2.531; SHIELD7 2.729,-2.531 | smd 1 x 1: SHIELD6 2.7,-2.575 | smd 1.1 x 1.5: SHIELD8 -2.731,-2.731 | smd 1 x 1.3 bottom: SHIELD9 -2.43,0.195; SHIELD10 2.43,0.195
1X07_NO_SILK = drill 1.016 pad 1.88: 1 0,0; 2 2.54,0; 3 5.08,0; 4 7.62,0; 5 10.16,0; 6 12.7,0; 7 15.24,0
2X5-PTH-1.27MM = drill 0.508 pad 1: 1 -2.54,-0.635; 2 -2.54,0.635; 3 -1.27,-0.635; 4 -1.27,0.635; 5 0,-0.635; 6 0,0.635; 7 1.27,-0.635; 8 1.27,0.635; 9 2.54,-0.635; 10 2.54,0.635
1X11_NO_SILK = drill 1.016 pad 1.88: 1 0,0; 2 2.54,0; 3 5.08,0; 4 7.62,0; 5 10.16,0; 6 12.7,0; 7 15.24,0; 8 17.78,0; 9 20.32,0; 10 22.86,0; 11 25.4,0
1X01_NO_SILK = drill 1.016 pad 1.88: 1 0,0
TACTILE_SWITCH_SMD_RIGHT_ANGLE = smd 1.1 x 2: 1 -1.95,0; 2 1.95,0 | hole 0.7: 0,0.9; 0,-0.9
SWITCH_SPST_SMD_A = smd 0.7 x 1.5: 1 -2.25,-1.75; 2 -0.75,-1.75; 3 2.25,-1.75 | smd 1 x 0.6: GND1 -3.65,1; GND3 3.65,1 | smd 1 x 0.8: GND2 -3.65,-1.1; GND4 3.65,-1.1 | hole 0.9: -1.5,0; 1.5,0
MDBT50Q = smd 0.6 x 0.4: 1 -4.65,3.65; 2 -4.65,2.55; 3 -4.65,1.75; 4 -4.65,0.15; 5 -3.75,-0.25; 6 -4.65,-0.65; 7 -3.75,-1.05; 8 -4.65,-1.45; 9 -3.75,-1.85; 10 -4.65,-2.25; 11 -3.75,-2.65; 12 -4.65,-3.05; 13 -3.75,-3.45; 14 -4.65,-3.85; 34 4.65,-6.25; 35 4.65,-5.45; 36 3.75,-5.05; 37 4.65,-4.65; 38 3.75,-4.25; 39 4.65,-3.85; 40 3.75,-3.45; 41 4.65,-3.05; 42 3.75,-2.65; 43 3.75,-1.85; 44 4.65,-1.45; 45 3.75,-1.05; 46 4.65,-0.65; 47 3.75,-0.25; 48 4.65,0.15; 49 3.75,0.55; 50 3.75,1.35; 51 4.65,1.75; 52 3.75,2.15; 53 4.65,2.55; 54 3.75,2.95; 55 4.65,3.65 | smd 0.4 x 0.6: 15 -4.8,-7.25; 16 -4,-7.25; 17 -3.2,-7.25; 18 -2.4,-7.25; 19 -2,-6.35; 20 -1.6,-7.25; 21 -1.2,-6.35; 22 -0.8,-7.25; 23 -0.4,-6.35; 24 0,-7.25; 25 0.4,-6.35; 26 0.8,-7.25; 27 1.2,-6.35; 28 1.6,-7.25; 29 2,-6.35; 30 2.4,-7.25; 31 3.2,-7.25; 32 4,-7.25; 33 4.8,-7.25; 56 -2,-0.65; 57 -1.2,-0.65; 58 -0.4,-0.65; 59 0.4,-0.65; 60 1.2,-0.65; 61 2,-0.65
SOT23-5 = smd 0.55 x 1.2: 1 -0.95,-1.3; 2 0,-1.3; 3 0.95,-1.3; 4 0.95,1.3; 5 -0.95,1.3
CRYSTAL-SMD-3.2X1.5MM = smd 1 x 1.8: P$1 -1.25,0; P$2 1.25,0

### Placement (x,y rotation side)
C1  31.5,7.49 180 top
C2  31.5,9.02 180 top
C3  29.97,15.88 90 top
C4  31.5,10.54 180 top
C5  17.14,13.97 180 top
C6  17.14,8.51 180 top
C7  31.5,13.21 0 top
C8  25.4,16.51 0 top
C9  28.45,13.94 90 top
C10  43.18,6.99 90 bottom
C11  40.64,6.99 90 bottom
D1  25.4,11.43 0 top
D2  7.62,19.05 0 top
D3  20.45,12.06 180 top
D4  20.45,10.16 180 top
D6  7.62,12.95 270 top
FD1  16.89,20.7 0 top
FD2  45.09,2.54 0 top
FD3  45.09,2.54 0 bottom
FD4  16.89,20.7 0 bottom
FRAME1  2.54,-10.16 0 top  (outside the outline)
J1  3.45,7.01 90 top
J2  44.45,19.05 180 top
J3  24.13,4.95 0 top
J4  42.8,12.7 270 top
J5  19.05,3.81 180 top
J6  4.95,16.15 270 top
J7  44.45,3.81 180 top
J8  38.1,11.43 270 bottom
J9  29.21,1.27 0 top
J10  19.05,21.59 0 top
J11  19.05,1.27 0 top
LOGO1  22.86,11.43 0 bottom
LOGO2  5.08,5.08 0 bottom
R1  8.26,15.75 0 top
R2  8.26,17.27 0 top
R3  25.4,9.91 0 top
R4  20.45,15.44 180 top
R5  20.45,8.51 180 top
R6  17.14,6.99 0 top
R7  20.45,6.99 0 top
R10  17.14,15.49 0 top
S1  12.7,18.8 180 top
S2  11.99,11.4 90 top
S3  12.7,4.06 0 top
U1  41.61,11.43 270 top
U2  17.17,11.28 0 top
U3  25.4,13.97 270 top
U$1  [625]  27.56,10.29 90 top
U$2  [#RST7]  10.79,16.43 0 top
U$3  [PGM2]  10.44,6.43 0 top
U$4  [ON#OFF4]  9.96,7.77 90 top
U$5  [CHG26]  9.73,17.22 90 top
U$6  [PWR27]  6.58,10.97 90 top
U$7  [1125]  19.05,4.75 90 bottom
U$8  [QWIIC0]  21.69,6.58 0 top
U$9  [20]  44.45,15.75 90 bottom
U$10  [31]  41.91,15.75 90 bottom
U$11  [292]  39.37,15.01 90 bottom
U$12  [313]  36.83,15.21 90 bottom
U$13  [304]  34.29,14.99 90 bottom
U$14  [285]  31.75,15.01 90 bottom
U$15  [521]  29.21,15.82 90 bottom
U$16  [421]  26.67,15.75 90 bottom
U$17  [3#3V5]  24.13,13.69 90 bottom
U$18  [#RST6]  21.59,14.38 90 bottom
U$19  [GND7]  19.05,13.69 90 bottom
U$20  [VIN8]  16.51,14.3 90 bottom
U$21  [1022]  44.45,4.8 90 bottom
U$22  [916]  41.91,4.8 90 bottom
U$23  [2111]  39.37,4.62 90 bottom
U$24  [1912]  36.83,4.8 90 bottom
U$25  [1713]  34.29,4.8 90 bottom
U$26  [1522]  31.75,4.75 90 bottom
U$27  [1314]  29.21,4.8 90 bottom
U$29  [816]  16.51,4.8 90 bottom
U$30  [GND6]  26.26,1.27 0 bottom
U$31  [NRF52840_BREAKOUT17]  30.48,9.53 0 bottom
U$32  [SCL#2323]  27.3,3.81 0 bottom
U$33  [SDA#2024]  27.43,5.33 0 bottom
Y1  32,15.88 90 top

### Tracks (layer width: path | path; a pad name or v marks a point on that pad's centre or on a via)
3.3V  (via drill 0.3)
  Top 0.152: J8.1 38.05,14.65 37.81,14.65 37.77,14.7 37.16,14.7 36.74,14.27 36.74,9.83 35.9,9 34.38,9 U1.30 | R7.2 23.63,6.99 | R10.2 18.03,15.49 18.09,15.44 R4.2 20.33,14.71 22.43,14.71
  Top 0.254: U3.5 27.04,14.92 27.48,14.48 v27.48,14.12 28.45,13.16 C9.1 29.61,11.94 30.99,11.94 32.35,10.58 C4.1 C2.1 | C1.1 C2.1 | U1.30 33.33,9.03 | 33.33,9.03 C2.1 | U1.28 33.71,9.83 33.33,9.45 33.33,9.03 | J2.9 22.43,17.35 22.43,14.71 22.43,10.08 23.63,8.88 23.63,6.99 J3.2
  Bottom 0.254: J2.9 27.48,15.7 v27.48,14.12
!RESET
  Top 0.152: U1.40 38.16,8.2 J8.10 | S1.2 12.49,17.06 21.28,17.06 21.3,17.04 | R4.1 21.3,17.04 | 21.3,17.04 21.3,18.76 J2.10
  Bottom 0.152: J2.10 21.8,19.05 28.58,12.27 34.84,12.27 36.68,10.43 36.68,9.68 J8.10
D+  (via drill 0.3)
  Top 0.254: U1.35 36.16,7.1 v35.72,7.54 | R1.2 v10.26,15.75
  Bottom 0.254: v35.72,7.54 35.57,7.39 24.84,7.39 16.48,15.75 v10.26,15.75
D+_CON
  Top 0.254: J6.D+ 6.87,16.15 7.28,15.75 R1.1
D-  (via drill 0.3)
  Top 0.254: U1.34 35.35,6.99 35.12,7.22 v35.12,8.46 | R2.2 v10.46,17.27
  Bottom 0.254: v35.12,8.46 34.47,7.8 25.01,7.8 16.65,16.15 11.58,16.15 v10.46,17.27
D-_CON
  Top 0.254: J6.D- 6.81,16.8 7.28,17.27 R2.1
GND  (via drill 0.3)
  Top 0.254: U1.55 45.26,7.3 45.03,7.52 | v6.48,14.83 4.97,14.83 J6.GND
  other vias: 16.87,11.1 15.37,7.75 15.24,12.75 4.32,6.05 7.14,4.9 22.66,6.22 27.43,11.68 23.01,14.63 28.96,16.03 29.59,13.36 35.26,16.23 33.45,16.23 34.37,17.04 44.17,15.27 44.17,17.02 22.4,8.53 12.34,13.77 44.58,9.47 12.09,15.09
  pour Top (isolate 0.152, rank 6): 0,2.54 15.24,2.54 arc-90 16.51,1.27 arc90 17.78,0 45.72,0 45.72,22.86 17.78,22.86 arc90 16.51,21.59 arc-90 15.24,20.32 0,20.32
  pour Bottom (isolate 0.152, rank 6): 0,2.54 15.24,2.54 arc-90 16.51,1.27 arc90 17.78,0 45.72,0 45.72,22.86 17.78,22.86 arc90 16.51,21.59 arc-90 15.24,20.32 0,20.32
N$1
  Top 0.152: U2.5 16.89,12.57 17.86,11.61 18.24,11.61 18.93,10.91 19.6,10.91 19.84,10.67 19.84,9.4 19.6,9.15 R5.2
N$2  (via drill 0.3)
  Top 0.152: U3.3 23.12,13.02 v23.01,13.13 | S2.2 13.74,12 14.72,12.98 14.72,14.03 15.38,14.7 19.91,14.7 20.21,14.4 21.05,13.56 v21.3,13.56
  Bottom 0.152: v23.01,13.13 22.46,13.13 22.03,13.56 v21.3,13.56
N$3  (via drill 0.3)
  Top 0.152: v19.02,5.97 v19.01,5.97 R6.2 | D2.C 9.21,19.76 v9.4,19.76
  Bottom 0.152: v19.02,5.97 18.97,5.92 10.54,5.92 8.89,7.57 8.89,19.25 v9.4,19.76
N$4
  Top 0.152: U2.1 15.74,9.98 14.83,9.07 14.83,7.43 15.28,6.99 R6.1
N$7
  Top 0.152: D1.A 24.52,9.93 R3.1
N$10
  Top 0.152: D6.A 8.12,14.33 13.6,14.33 14.77,15.49 R10.1
P0.02/AIN0
  Top 0.152: U1.11 38.95,15.04 39.65,14.35 41.78,14.35 42.49,15.06 42.49,17.09 J2.1
P0.03/AIN1
  Top 0.152: U1.9 39.76,15.06 40.16,14.65 41.65,14.65 42.18,15.19 42.18,18.79 J2.2
P0.04/AIN2  (via drill 0.3)
  Top 0.152: U1.20 33.81,13.03 v33.58,13.26
  Bottom 0.152: v33.58,13.26 33.58,14.63 30.35,17.86 27.86,17.86 J2.8
P0.05/AIN3  (via drill 0.3)
  Top 0.152: U1.21 v36.01,12.63 v36.02,12.62
  Bottom 0.152: v36.02,12.62 29.59,19.05 J2.7
P0.06  (via drill 0.3)
  Top 0.152: v32.02,11.73 32.51,12.23 U1.22 | R3.2 26.89,9.91 v27.28,10.3
  Bottom 0.152: v32.02,11.73 31.79,11.51 29.64,11.51 28.43,10.3 v27.28,10.3
P0.08  (via drill 0.3)
  Top 0.152: U1.24 33.05,11.43 v32.78,11.7 | v27.69,9.63 27.69,7.24 26.16,5.71 26.16,4.18 26.02,4.05 21.35,4.05 20.32,5.08 17.78,5.08 J5.2
  Bottom 0.152: v32.78,11.7 32.28,11.2 29.77,11.2 28.52,9.96 28.02,9.96 v27.69,9.63
P0.09/NFC1  (via drill 0.3)
  Top 0.152: U1.52 43.76,8.57 v44.03,8.84
  Bottom 0.152: C11.1 41.29,5.49 41.9,5.49 | J7.2 41.91,5.49 41.9,5.49 | 41.9,5.49 42.16,5.75 42.16,8.38 42.62,8.84 v44.03,8.84
P0.10/NFC2
  Top 0.152: U1.54 44.55,7.2 44.58,7.17 44.58,3.94 J7.1
  Bottom 0.152: C10.1 43.18,5.07 44.44,3.81 J7.1
P0.11  (via drill 0.3)
  Top 0.152: J5.1 21.16,3.81 21.22,3.75 26.15,3.75 26.46,4.06 26.46,5.58 27.99,7.11 27.99,8.99 v28.42,9.42 | U1.27 v36.11,10.23 v36.12,10.24
  Bottom 0.152: v36.12,10.24 29.23,10.24 v28.42,9.42
P0.13
  Top 0.152: J7.7 30.99,5.59 36.5,5.59 36.95,6.04 U1.37
P0.15
  Top 0.152: J7.6 33.22,5.28 36.65,5.28 37.76,6.39 U1.39
P0.17
  Top 0.152: J7.5 35.46,4.98 36.8,4.98 38.55,6.73 U1.41
P0.19
  Top 0.152: U1.42 38.95,7.2 38.98,7.17 38.98,6.38 36.83,4.23 J7.4
P0.20  (via drill 0.3)
  Top 0.152: J3.3 24.63,6.09 v24.64,6.1 | U1.44 40.13,6.76 40.13,5.99 39.91,5.78 v39.56,5.78
  Bottom 0.152: v24.64,6.1 24.97,5.77 39.55,5.77 v39.56,5.78
P0.21
  Top 0.152: U1.43 39.76,7.24 39.29,6.78 39.29,6.26 39.03,6 39.03,4.15 J7.3
P0.22  (via drill 0.3)
  Top 0.152: U1.46 40.95,5.74 40.34,5.13 v40.03,5.13 | v13.59,4.06 S3.2 | R7.1 19.75,6.83 v19.75,5.61
  Bottom 0.152: v13.59,4.06 14.96,5.44 19.57,5.44 v19.75,5.61 19.9,5.46 37.81,5.46 38.15,5.13 v40.03,5.13
P0.23  (via drill 0.3)
  Top 0.152: J3.4 25.63,5.93 v26.1,6.41 | v39.68,8.44 40.33,8.44 40.55,8.21 U1.45
  Bottom 0.152: v26.1,6.41 26.43,6.08 38.16,6.08 39.68,7.6 v39.68,8.44
P0.28/AIN4
  Top 0.152: U1.13 37.83,15.18 35.23,17.78 33.78,17.78 32.51,19.05 J2.6
P0.29/AIN5
  Top 0.152: U1.10 39.37,16.09 J2.3
P0.30/AIN6
  Top 0.152: U1.14 37.36,16.08 35.36,18.09 35.26,18.09 J2.5
P0.31/AIN7
  Top 0.152: U1.12 38.55,17.32 J2.4
SHIELD  (via drill 0.3)
  other vias: 0.56,12.42 0.56,15.21 0.56,17.25 0.56,19.74
  pour Top (isolate 0.152): 0,12.19 5.46,12.19 5.46,20.32 0,20.32
  pour Bottom (isolate 0.152): 0,12.19 5.84,12.19 5.84,20.32 0,20.32
SWDCLK  (via drill 0.3)
  Top 0.152: U1.53 44.16,5.41 v44.05,5.31
  Bottom 0.152: J8.4 36.74,13.43 36.74,14.27 37.47,15 42.15,15 43.97,13.18 43.97,11.33 | 43.97,11.33 J4.2 | v44.05,5.31 45.24,6.5 45.24,10.06 43.97,11.33
SWDIO  (via drill 0.3)
  Top 0.152: U1.51 43.35,6.14 43.23,6.02 v41.6,6.02
  Bottom 0.152: J8.2 38.19,14.7 40.8,14.7 J4.1 41.63,11.53 41.63,6.05 v41.6,6.02
V_BATT  (via drill 0.3)
  Top 0.152: D4.A 18.3,10.16 U2.3
  Top 0.254: C6.1 18,9.85 U2.3 18.12,10.96 v18.01,11.07 | v10.03,8 7.11,8 7.12,8.01 J1.2
  Bottom 0.254: v10.03,8 14.79,8 17.87,11.07 v18.01,11.07
V_USB  (via drill 0.3)
  Top 0.254: J6.VBUS 5.9,17.45 6.49,18.05 6.73,18.05 | U2.4 18.12,13.72 | 18.12,13.72 18.12,13.85 C5.1 | U1.32 33.77,7.43 33.35,7.85 v33.35,8.38 | 19.3,13.07 D3.A | v19.96,13.74 19.3,13.07 | 6.73,18.05 9.56,18.05 v9.74,18.23 | D2.A 6.73,19.04 6.73,18.05 | 18.12,13.72 18.66,13.72 19.3,13.07
  Bottom 0.254: v33.35,8.38 33.17,8.2 25.2,8.2 19.96,13.44 v19.96,13.74 19.64,13.74 16.82,16.56 12,16.56 10.71,17.86 10.12,17.86 v9.74,18.23
VIN  (via drill 0.3)
  Top 0.152: D4.C 20.47,10.16 v20.37,10.07 | v14.84,9.85 14.15,9.15 S2.1
  Top 0.254: D4.C D3.C 21.6,12.72 v21.84,12.97 | 25.27,14.91 25.27,12.74 24.9,12.37 v23.01,12.37 | 25.27,14.91 25.27,15.79 C8.1 23.59,16.51 v23.01,17.08 | 25.27,14.91 25.26,14.92 U3.1
  Bottom 0.152: v20.37,10.07 20.37,10.1 18.31,12.17 17.16,12.17 v14.84,9.85
  Bottom 0.254: v23.01,12.37 22.45,12.37 v21.84,12.97 | v23.01,17.08 22.95,17.14 18.41,17.14 J2.12
XL1
  Top 0.152: U1.17 33.76,14.63 32,16.38 32,17.02 | 32,17.02 Y1.P$2 | C3.2 30.27,17.02 32,17.02
XL2
  Top 0.152: U1.18 33.16,13.83 32.37,14.62 Y1.P$1 32,13.55 C7.2

### Text on the board
Bottom: x01
tDocu: Jim Lindblom